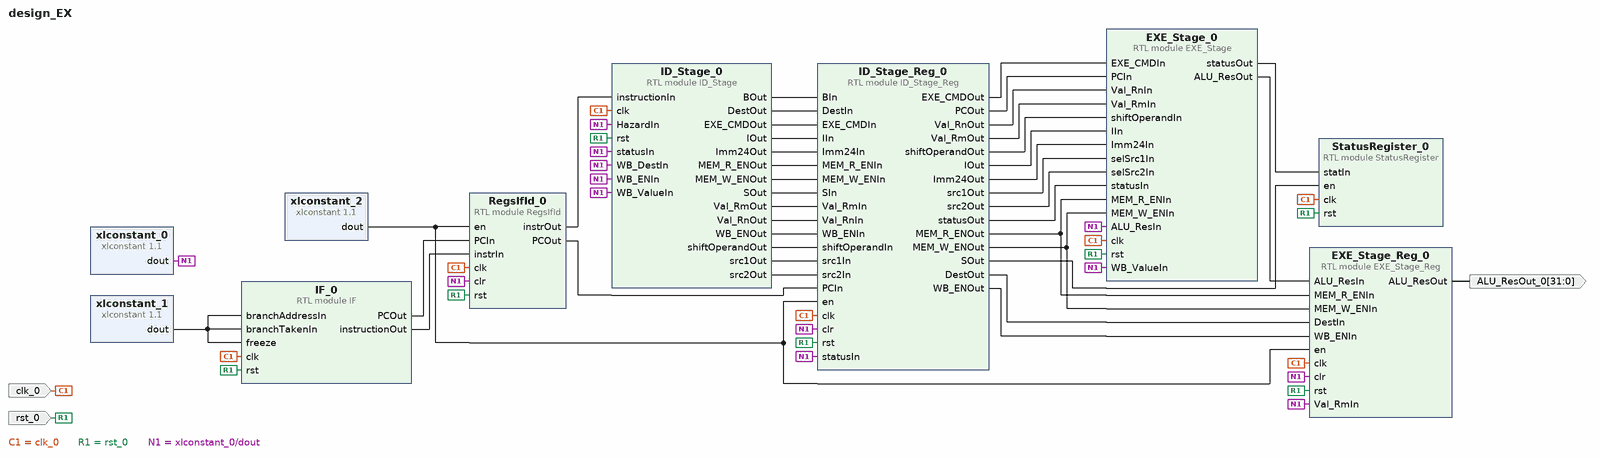
[diagram p0: block diagram of the top level]
# Vivado block design design_EX, xc7z010clg400-1, Vivado 2018.3
create_bd_design design_EX

create_bd_port -dir I -type clk clk_0
create_bd_port -dir I -type rst rst_0
create_bd_port -dir O -from 31 -to 0 ALU_ResOut_0

create_bd_cell -type module -reference StatusRegister StatusRegister_0
create_bd_cell -type ip -vlnv xilinx.com:ip:xlconstant:1.1 xlconstant_0
set_property -dict {CONFIG.CONST_VAL 0 CONFIG.CONST_WIDTH 32} [get_bd_cells xlconstant_0]
create_bd_cell -type module -reference RegsIfId RegsIfId_0
create_bd_cell -type module -reference ID_Stage ID_Stage_0
create_bd_cell -type module -reference ID_Stage_Reg ID_Stage_Reg_0
create_bd_cell -type module -reference EXE_Stage EXE_Stage_0
create_bd_cell -type module -reference EXE_Stage_Reg EXE_Stage_Reg_0
create_bd_cell -type module -reference IF IF_0
create_bd_cell -type ip -vlnv xilinx.com:ip:xlconstant:1.1 xlconstant_1
set_property -dict {CONFIG.CONST_VAL 0} [get_bd_cells xlconstant_1]
create_bd_cell -type ip -vlnv xilinx.com:ip:xlconstant:1.1 xlconstant_2

# ---- connections ----

connect_bd_net [get_bd_pins ID_Stage_0/BOut] [get_bd_pins ID_Stage_Reg_0/BIn]
connect_bd_net [get_bd_pins ID_Stage_0/DestOut] [get_bd_pins ID_Stage_Reg_0/DestIn]
connect_bd_net [get_bd_pins ID_Stage_0/EXE_CMDOut] [get_bd_pins ID_Stage_Reg_0/EXE_CMDIn]
connect_bd_net [get_bd_pins ID_Stage_0/IOut] [get_bd_pins ID_Stage_Reg_0/IIn]
connect_bd_net [get_bd_pins ID_Stage_0/Imm24Out] [get_bd_pins ID_Stage_Reg_0/Imm24In]
connect_bd_net [get_bd_pins ID_Stage_0/MEM_R_ENOut] [get_bd_pins ID_Stage_Reg_0/MEM_R_ENIn]
connect_bd_net [get_bd_pins ID_Stage_0/MEM_W_ENOut] [get_bd_pins ID_Stage_Reg_0/MEM_W_ENIn]
connect_bd_net [get_bd_pins ID_Stage_0/SOut] [get_bd_pins ID_Stage_Reg_0/SIn]
connect_bd_net [get_bd_pins ID_Stage_0/Val_RmOut] [get_bd_pins ID_Stage_Reg_0/Val_RmIn]
connect_bd_net [get_bd_pins ID_Stage_0/Val_RnOut] [get_bd_pins ID_Stage_Reg_0/Val_RnIn]
connect_bd_net [get_bd_pins ID_Stage_0/WB_ENOut] [get_bd_pins ID_Stage_Reg_0/WB_ENIn]
connect_bd_net [get_bd_pins ID_Stage_0/shiftOperandOut] [get_bd_pins ID_Stage_Reg_0/shiftOperandIn]
connect_bd_net [get_bd_pins ID_Stage_0/src1Out] [get_bd_pins ID_Stage_Reg_0/src1In]
connect_bd_net [get_bd_pins ID_Stage_0/src2Out] [get_bd_pins ID_Stage_Reg_0/src2In]
connect_bd_net -net IF_0_PC [get_bd_pins IF_0/PCOut] [get_bd_pins RegsIfId_0/PCIn]
connect_bd_net -net RegsIfId_0_instructionOut [get_bd_pins RegsIfId_0/instrOut] [get_bd_pins ID_Stage_0/instructionIn]
connect_bd_net [get_bd_pins RegsIfId_0/PCOut] [get_bd_pins ID_Stage_Reg_0/PCIn]
connect_bd_net -net clk_0_1 [get_bd_ports clk_0] \
  [get_bd_pins StatusRegister_0/clk] [get_bd_pins RegsIfId_0/clk] [get_bd_pins ID_Stage_0/clk] \
  [get_bd_pins ID_Stage_Reg_0/clk] [get_bd_pins EXE_Stage_0/clk] [get_bd_pins EXE_Stage_Reg_0/clk] [get_bd_pins IF_0/clk]
connect_bd_net -net rst_0_1 [get_bd_ports rst_0] \
  [get_bd_pins StatusRegister_0/rst] [get_bd_pins RegsIfId_0/rst] [get_bd_pins ID_Stage_0/rst] \
  [get_bd_pins ID_Stage_Reg_0/rst] [get_bd_pins EXE_Stage_0/rst] [get_bd_pins EXE_Stage_Reg_0/rst] [get_bd_pins IF_0/rst]
connect_bd_net [get_bd_pins ID_Stage_Reg_0/MEM_R_ENOut] [get_bd_pins EXE_Stage_0/MEM_R_ENIn] [get_bd_pins EXE_Stage_Reg_0/MEM_R_ENIn]
connect_bd_net [get_bd_pins ID_Stage_Reg_0/MEM_W_ENOut] [get_bd_pins EXE_Stage_0/MEM_W_ENIn] [get_bd_pins EXE_Stage_Reg_0/MEM_W_ENIn]
connect_bd_net [get_bd_pins ID_Stage_Reg_0/EXE_CMDOut] [get_bd_pins EXE_Stage_0/EXE_CMDIn]
connect_bd_net [get_bd_pins ID_Stage_Reg_0/PCOut] [get_bd_pins EXE_Stage_0/PCIn]
connect_bd_net [get_bd_pins ID_Stage_Reg_0/Val_RnOut] [get_bd_pins EXE_Stage_0/Val_RnIn]
connect_bd_net [get_bd_pins ID_Stage_Reg_0/Val_RmOut] [get_bd_pins EXE_Stage_0/Val_RmIn]
connect_bd_net [get_bd_pins ID_Stage_Reg_0/shiftOperandOut] [get_bd_pins EXE_Stage_0/shiftOperandIn]
connect_bd_net [get_bd_pins ID_Stage_Reg_0/IOut] [get_bd_pins EXE_Stage_0/IIn]
connect_bd_net [get_bd_pins ID_Stage_Reg_0/Imm24Out] [get_bd_pins EXE_Stage_0/Imm24In]
connect_bd_net [get_bd_pins ID_Stage_Reg_0/src1Out] [get_bd_pins EXE_Stage_0/selSrc1In]
connect_bd_net [get_bd_pins ID_Stage_Reg_0/src2Out] [get_bd_pins EXE_Stage_0/selSrc2In]
connect_bd_net [get_bd_pins EXE_Stage_0/ALU_ResOut] [get_bd_pins EXE_Stage_Reg_0/ALU_ResIn]
connect_bd_net [get_bd_pins ID_Stage_Reg_0/DestOut] [get_bd_pins EXE_Stage_Reg_0/DestIn]
connect_bd_net [get_bd_pins ID_Stage_Reg_0/statusOut] [get_bd_pins EXE_Stage_0/statusIn]
connect_bd_net [get_bd_pins ID_Stage_Reg_0/SOut] [get_bd_pins StatusRegister_0/en]
connect_bd_net [get_bd_pins EXE_Stage_0/statusOut] [get_bd_pins StatusRegister_0/statIn]
connect_bd_net -net freeze_1_1 [get_bd_pins xlconstant_1/dout] \
  [get_bd_pins IF_0/freeze] [get_bd_pins IF_0/branchTakenIn] [get_bd_pins IF_0/branchAddressIn]
connect_bd_net [get_bd_pins ID_Stage_Reg_0/WB_ENOut] [get_bd_pins EXE_Stage_Reg_0/WB_ENIn]
connect_bd_net [get_bd_pins EXE_Stage_Reg_0/ALU_ResOut] [get_bd_ports ALU_ResOut_0]
connect_bd_net [get_bd_pins xlconstant_0/dout] \
  [get_bd_pins ID_Stage_0/WB_ENIn] [get_bd_pins ID_Stage_0/WB_DestIn] [get_bd_pins ID_Stage_0/WB_ValueIn] \
  [get_bd_pins ID_Stage_0/HazardIn] [get_bd_pins ID_Stage_0/statusIn] [get_bd_pins ID_Stage_Reg_0/statusIn] \
  [get_bd_pins EXE_Stage_0/WB_ValueIn] [get_bd_pins EXE_Stage_0/ALU_ResIn] [get_bd_pins EXE_Stage_Reg_0/Val_RmIn] \
  [get_bd_pins RegsIfId_0/clr] [get_bd_pins ID_Stage_Reg_0/clr] [get_bd_pins EXE_Stage_Reg_0/clr]
connect_bd_net [get_bd_pins IF_0/instructionOut] [get_bd_pins RegsIfId_0/instrIn]
connect_bd_net [get_bd_pins xlconstant_2/dout] [get_bd_pins RegsIfId_0/en] [get_bd_pins ID_Stage_Reg_0/en] [get_bd_pins EXE_Stage_Reg_0/en]

validate_bd_design
save_bd_design
